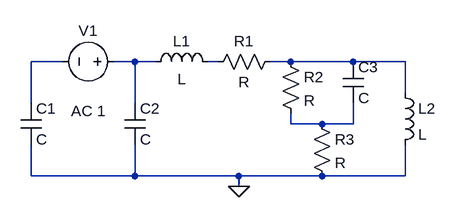
[diagram p0: schematic EA_EX6_CaixaDutada.asc]
EA_EX6_CaixaDutada.asc, the LTspice schematic file:
Version 4
SHEET 1 880 680
WIRE -32 64 -80 64
WIRE 80 64 48 64
WIRE 112 64 80 64
WIRE 208 64 192 64
WIRE 320 64 288 64
WIRE 416 64 320 64
WIRE 496 64 416 64
WIRE 496 112 496 64
WIRE -80 128 -80 64
WIRE 80 128 80 64
WIRE 320 160 320 144
WIRE 368 160 320 160
WIRE 416 160 416 128
WIRE 416 160 368 160
WIRE -80 240 -80 192
WIRE 80 240 80 192
WIRE 80 240 -80 240
WIRE 240 240 80 240
WIRE 368 240 240 240
WIRE 496 240 496 192
WIRE 496 240 368 240
WIRE 240 256 240 240
FLAG 240 256 0
SYMBOL voltage 64 64 R90
WINDOW 0 -32 56 VBottom 2
WINDOW 3 32 56 VTop 2
WINDOW 123 60 56 VTop 2
WINDOW 39 0 0 Left 0
SYMATTR InstName V1
SYMATTR Value ""
SYMATTR Value2 AC 1
SYMBOL cap -96 128 R0
SYMATTR InstName C1
SYMBOL cap 64 128 R0
SYMATTR InstName C2
SYMBOL ind 96 80 R270
WINDOW 0 32 56 VTop 2
WINDOW 3 5 56 VBottom 2
SYMATTR InstName L1
SYMBOL res 304 48 R90
WINDOW 0 0 56 VBottom 2
WINDOW 3 32 56 VTop 2
SYMATTR InstName R1
SYMBOL res 304 48 R0
SYMATTR InstName R2
SYMBOL res 352 144 R0
SYMATTR InstName R3
SYMBOL cap 400 64 R0
SYMATTR InstName C3
SYMBOL ind 480 96 R0
SYMATTR InstName L2

The netlist it stands for:
* EA_EX6_CaixaDutada.asc
V1 N002 N001 AC 1
C1 N001 0 C
C2 N002 0 C
L1 N002 N003 L
R1 N004 N003 R
R2 N004 N005 R
R3 N005 0 R
C3 N004 N005 C
L2 N004 0 L
.backanno
.end